# Altium schematic sheet 2_ADC.SchDoc
size A4; SheetNumber: 2; SheetTotal: 6
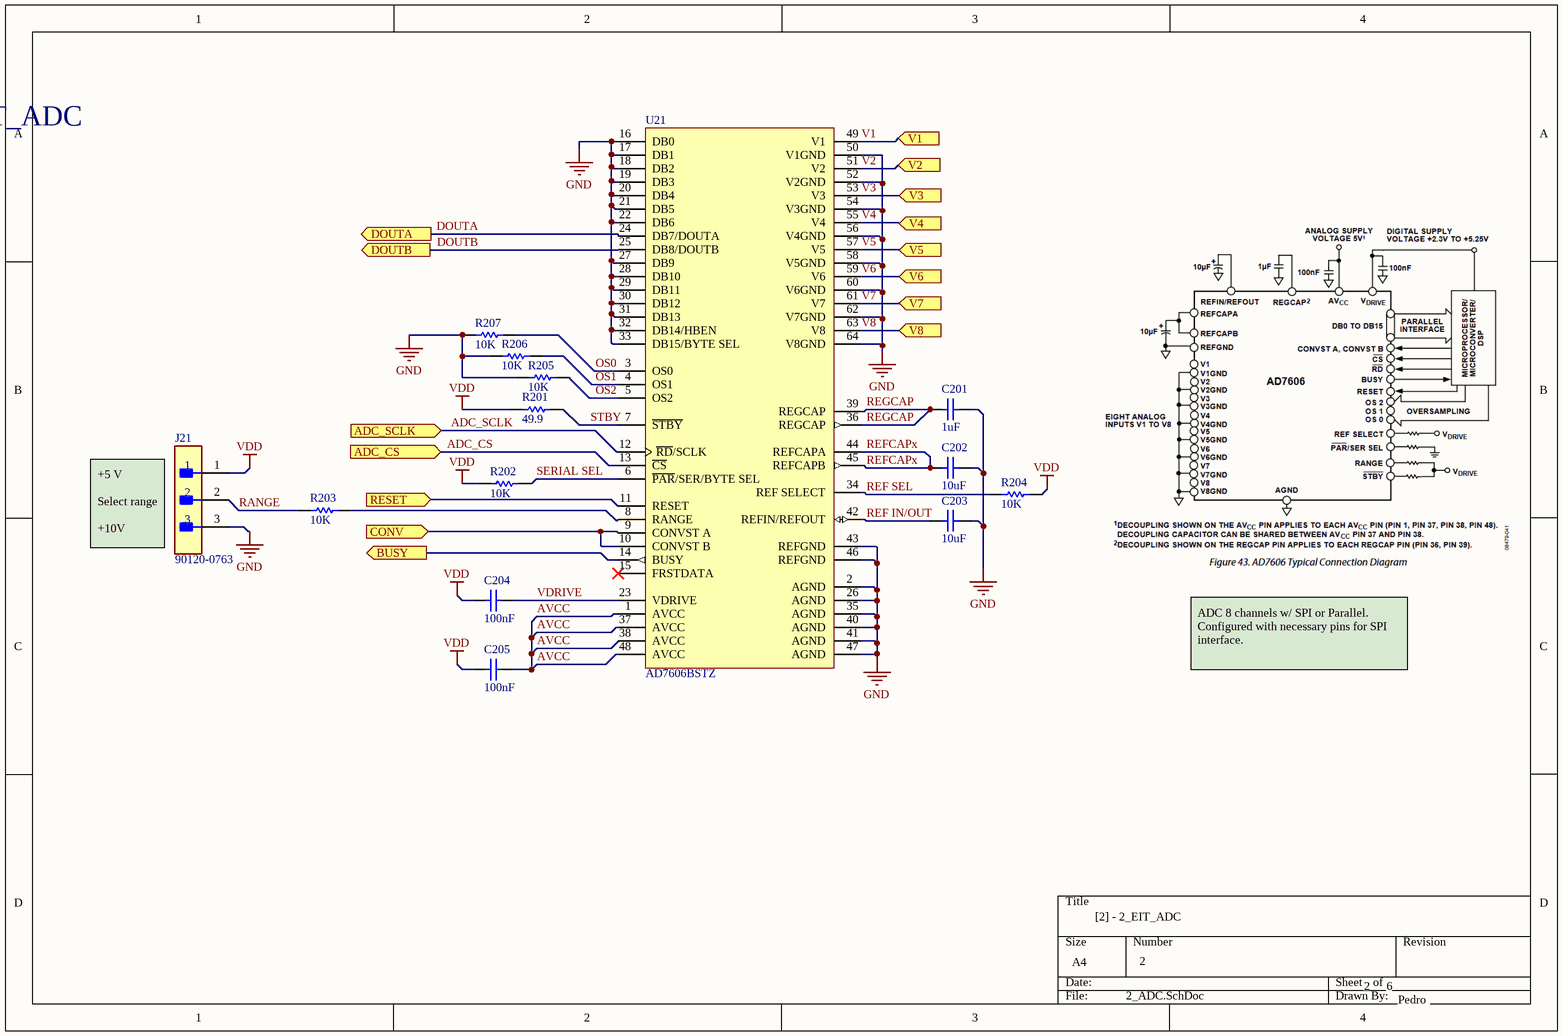
[diagram p0: 2_ADC.SchDoc]

## Parts
C201  value 1uF  [CAPC1005X55X30LL05T10]  (hidden comment: generic)
C202  value 10uF  [FP-C0603C-CF-IPC_A]  (hidden comment: generic)
C203  value 10uF  [FP-C0603C-CF-IPC_A]  (hidden comment: generic)
C204  value 100nF  [CAPC1005X55X30LL05T10]  (hidden comment: generic)
C205  value 100nF  [CAPC1005X55X30LL05T10]  (hidden comment: generic)
J21  90120-0763  [FP-90120-0763-MFG]
R201  Resistance: 49.9  [RESC1608X55X25LL10T15]  (hidden comment: RC0603JR-070RL)
R202  Resistance: 10K  [RESC1608X55X25LL10T15]  (hidden comment: RC0603JR-070RL)
R203  Resistance: 10K  [RESC1608X55X25LL10T15]  (hidden comment: RC0603JR-070RL)
R204  Resistance: 10K  [RESC1608X55X25LL10T15]  (hidden comment: RC0603JR-070RL)
R205  Resistance: 10K  [RESC1608X55X25LL10T15]  (hidden comment: RC0603JR-070RL)
R206  Resistance: 10K  [RESC1608X55X25LL10T15]  (hidden comment: RC0603JR-070RL)
R207  Resistance: 10K  [RESC1608X55X25LL10T15]  (hidden comment: RC0603JR-070RL)
U21  AD7606BSTZ  [ST-64-2_L]

## Ports
ADC_CS (in, see 1_RPi[2B]), ADC_SCLK (in, see 1_RPi[2B]), BUSY (out, see 1_RPi[2B]), CONV (in, see 1_RPi[2B]), DOUTA (out, see 1_RPi[2A]), DOUTB (out, see 1_RPi[2B]), RESET (in, see 1_RPi[2B]), V1 (in, see 1_RPi[2A]), V2 (in, see 1_RPi[2B]), V3 (in, see 1_RPi[2B]), V4 (in, see 1_RPi[2B]), V5 (in, see 1_RPi[2B]), V6 (in, see 1_RPi[2B]), V7 (in, see 1_RPi[2B]), V8 (in, see 1_RPi[2B])

## Nets
GND: C201.1 C202.1 C203.1 J21.3 R205.2 R206.2 R207.2 U21.2(AGND) U21.16(DB0) U21.17(DB1) U21.18(DB2) U21.19(DB3) U21.20(DB4) U21.21(DB5) U21.22(DB6) U21.26(AGND) U21.27(DB9) U21.28(DB10) U21.29(DB11) U21.30(DB12) U21.31(DB13) U21.32(DB14/HBEN) U21.33(DB15/BYTE_SEL) U21.35(AGND) U21.40(AGND) U21.41(AGND) U21.43(REFGND) U21.46(REFGND) U21.47(AGND) U21.50(V1GND) U21.52(V2GND) U21.54(V3GND) U21.56(V4GND) U21.58(V5GND) U21.60(V6GND) U21.62(V7GND) U21.64(V8GND)
VDD: C204.2 C205.2 J21.1 R201.2 R202.2 R204.1
ADC_CS: U21.13(~{CS}) ; port ADC_CS
ADC_SCLK: U21.12(~{RD}/SCLK) ; port ADC_SCLK
AVCC: C205.1 U21.1(AVCC) U21.37(AVCC) U21.38(AVCC) U21.48(AVCC)
BUSY: U21.14(BUSY) ; port BUSY
CONV: U21.9(CONVST_A) U21.10(CONVST_B) ; port CONV
DOUTA: U21.24(DB7/DOUTA) ; port DOUTA
DOUTB: U21.25(DB8/DOUTB) ; port DOUTB
OS0: R207.1 U21.3(OS0)
OS1: R206.1 U21.4(OS1)
OS2: R205.1 U21.5(OS2)
RANGE: J21.2 R203.2
REF IN/OUT: C203.2 U21.42(REFIN/REFOUT)
REF SEL: R204.2 U21.34(REF_SELECT)
REFCAPx: C202.2 U21.44(REFCAPA) U21.45(REFCAPB)
REGCAP: C201.2 U21.36(REGCAP) U21.39(REGCAP)
RESET: U21.11(RESET) ; port RESET
SERIAL SEL: R202.1 U21.6(~{PAR}/SER/BYTE_SEL)
STBY: R201.1 U21.7(~{STBY})
V1: U21.49(V1) ; port V1
V2: U21.51(V2) ; port V2
V3: U21.53(V3) ; port V3
V4: U21.55(V4) ; port V4
V5: U21.57(V5) ; port V5
V6: U21.59(V6) ; port V6
V7: U21.61(V7) ; port V7
V8: U21.63(V8) ; port V8
VDRIVE: C204.1 U21.23(VDRIVE)
NetR203_1: R203.1 U21.8(RANGE)

Not connected (* = marked no-connect by the designer): U21 15(FRSTDATA)*

## Notes on the sheet
- [2] - 2_EIT_ADC
- (near J21) +5 V
  Select range
  +10V
- ADC 8 channels w/ SPI or Parallel.
  Configured with necessary pins for SPI interface.
- 2
- 6
- Pedro

## Library data of the parts
C201-C205 = Capacitor: Device Class L1: Passive Components; Device Class L2: Capacitors
J21 = CMP-04776-000084-1: CONN HEADER VERT 3POS 2.54MM; Manufacturer: Molex; Voltage Rating: 350V; Number Of Contacts: 3; Conn Orientation: Vertical; Current Rating: 3A; Conn Gender: Male; Package: 90120-0763; ComponentLink2Description: Datasheet; Height: 5.8mm; Manufacturer Part Number: 90120-0763; Temperature Range High: +125°C; RoHS: TRUE; ComponentLink2URL: https://www.molex.com/webdocs/datasheets/pdf/en-us/0901200763_PCB_HEADERS.pdf; Device Class L2: Headers and Wire Housings; Temperature: -55°C to +125°C; Device Class L1: Connectors; Pitch: 2.54mm; Footprint Url: https://www.molex.com/pdm_docs/sd/901200763_sd.pdf; Device Class L3: unset; Temperature Range Low: -55°C; Number Of Rows: 1; Category: Conn; Lead Free: Yes; Mouser Description: Board-To-Board Connector, C-Grid III 90120 Series, Through Hole, Header, 3, 2.54 mm; Octopart: https://octopart.com/90120-0763-molex-655433; Contact Material: Gold,Nickel; Automotive: No; Digikey Description: CONN HEADER VERT 3POS 2.54MM
R201-R207 = RES-2: Chip Resistor, 0 Ohm, +/- 5%, 0.1 W, -55 to 155 degC, 0603 (1608 Metric), RoHS, Tape and Reel; Manufacturer: Yageo; Temperature Coefficient: 200ppm/degreesC; Voltage Rating: 50V; Power Rating: 100mW; Width: 0.8mm; Max Operating Temperature: 155degC; Tolerance: 5%; Package Reference: 0603; Height: 0.45mm; Depth: 0.8mm; Package Description: 2-Pin Surface Mount Device, Body 1.6 x 0.8 mm; Termination: SMD/SMT; Package Quantity: 5000; Case/Package: 0603; Case Code (Imperial): 0603; Radiation Hardening: No; Number of Pins: 2; Length: 1.6mm; Lead Free: LeadFree; Voltage Rating (DC): 50V; Military Standard: Not; Datasheet URL: http://www.yageo.com/NewPortal/yageodocoutput?fileName=/pdf/R-Chip/PYu-RC_Group_51_RoHS_L_5.pdf; Manufacturer URL: http://www.yageo.com/; Packaging: TapeandReel; Case Code (Metric): 1608; Min Operating Temperature: -55degC; Composition: ThickFilm; RoHSCompliant: true; Contact Plating: Tin; Datasheet Version: Rev. 5, 10/2016; REACH SVHC: NoSVHC
U21 = CMP-0313-00724-2: 8 Channel Data Acquisition System with 16-Bit, Bipolar Input, Simultaneous Sampling Analog-to-Digital Converter with Parallel, Serial and SPI Interface, 200KSPS, -40 to +85 degC, ST-64-2, Pb-Free, Tray; Generic Part Number: AD7606; Manufacturer: Analog Devices; Throughput Rate (SPS): 200K; Resolution (Bits): 16; Channels: 8; Interface: Par, Ser, SPI; ComponentLink2Description: Datasheet; ComponentLink1URL: http://www.analog.com/en/index.html; ComponentLink4URL: http://www.analog.com/en/analog-to-digital-converters/ad-converters/ad7606/products/product.html; DatasheetVersion: Rev.C; RoHS: Y; Code_JEDEC: MS-026-BCD; PartNumber: AD7606BSTZ; PackageVersion: 051706-A; Mounting Technology: Surface Mount; ComponentLink3URL: http://www.analog.com/static/imported-files/packages/PKG_PDF/LQFP%28ST%29/ST_64_2.pdf; PackageDescription: 64-Lead Low Profile Quad Flat Package [LQFP]; Packing: Tray; PackageReference: ST-64-2; ComponentLink1Description: Manufacturer URL; ComponentLink4Description: Product URL; ComponentLink2URL: http://www.analog.com/static/imported-files/data_sheets/AD7606_7606-6_7606-4.pdf; ComponentLink3Description: Package Specification; Supplier: Mouser; Supplier Part Number: 584-AD7606BSTZ; Manufacturer Part Number: AD7606BSTZ; Category: Analog to Digital Converters (ADCs); Stock: 2011; Pricing: 1=39,63, 10=37, 50=32,25, 100=31,46, 1000=31,46, 10000=31,46 (USD); ComponentLink5URL: https://datasheet.ciiva.com/1143/1595896-1143555.pdf?src-supplier=Element14; ComponentLink5Description: https://datasheet.ciiva.com/1143/1595896-1143555.pdf?src-supplier=Element14; ComponentLink6URL: https://datasheet.ciiva.com/3037/ad7606-7606-6-7606-4-3037717.pdf?src-supplier=Avnet; ComponentLink6Description: https://datasheet.ciiva.com/3037/ad7606-7606-6-7606-4-3037717.pdf?src-supplier=Avnet